# EasyEDA Pro project Main.eprj, board PCB2
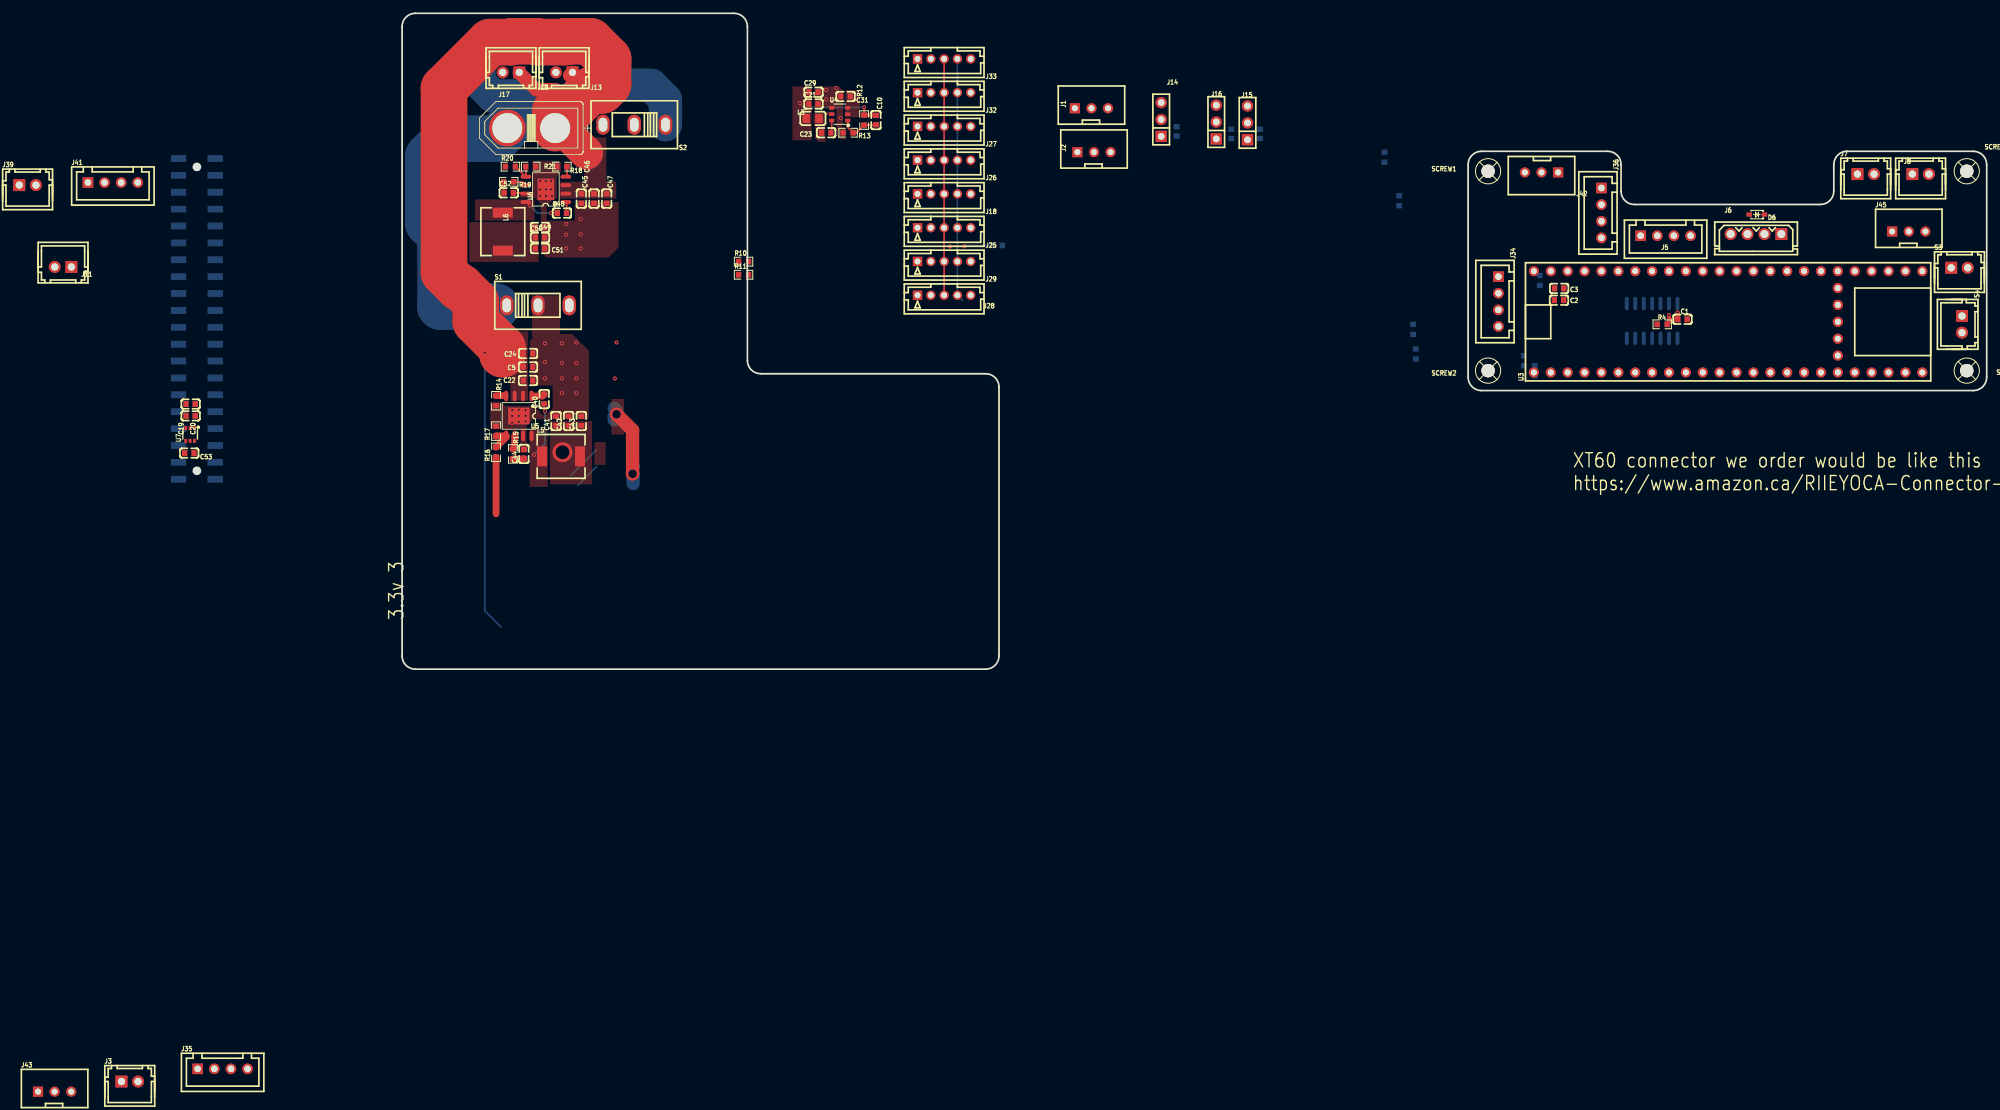
[diagram p8: board, top side]
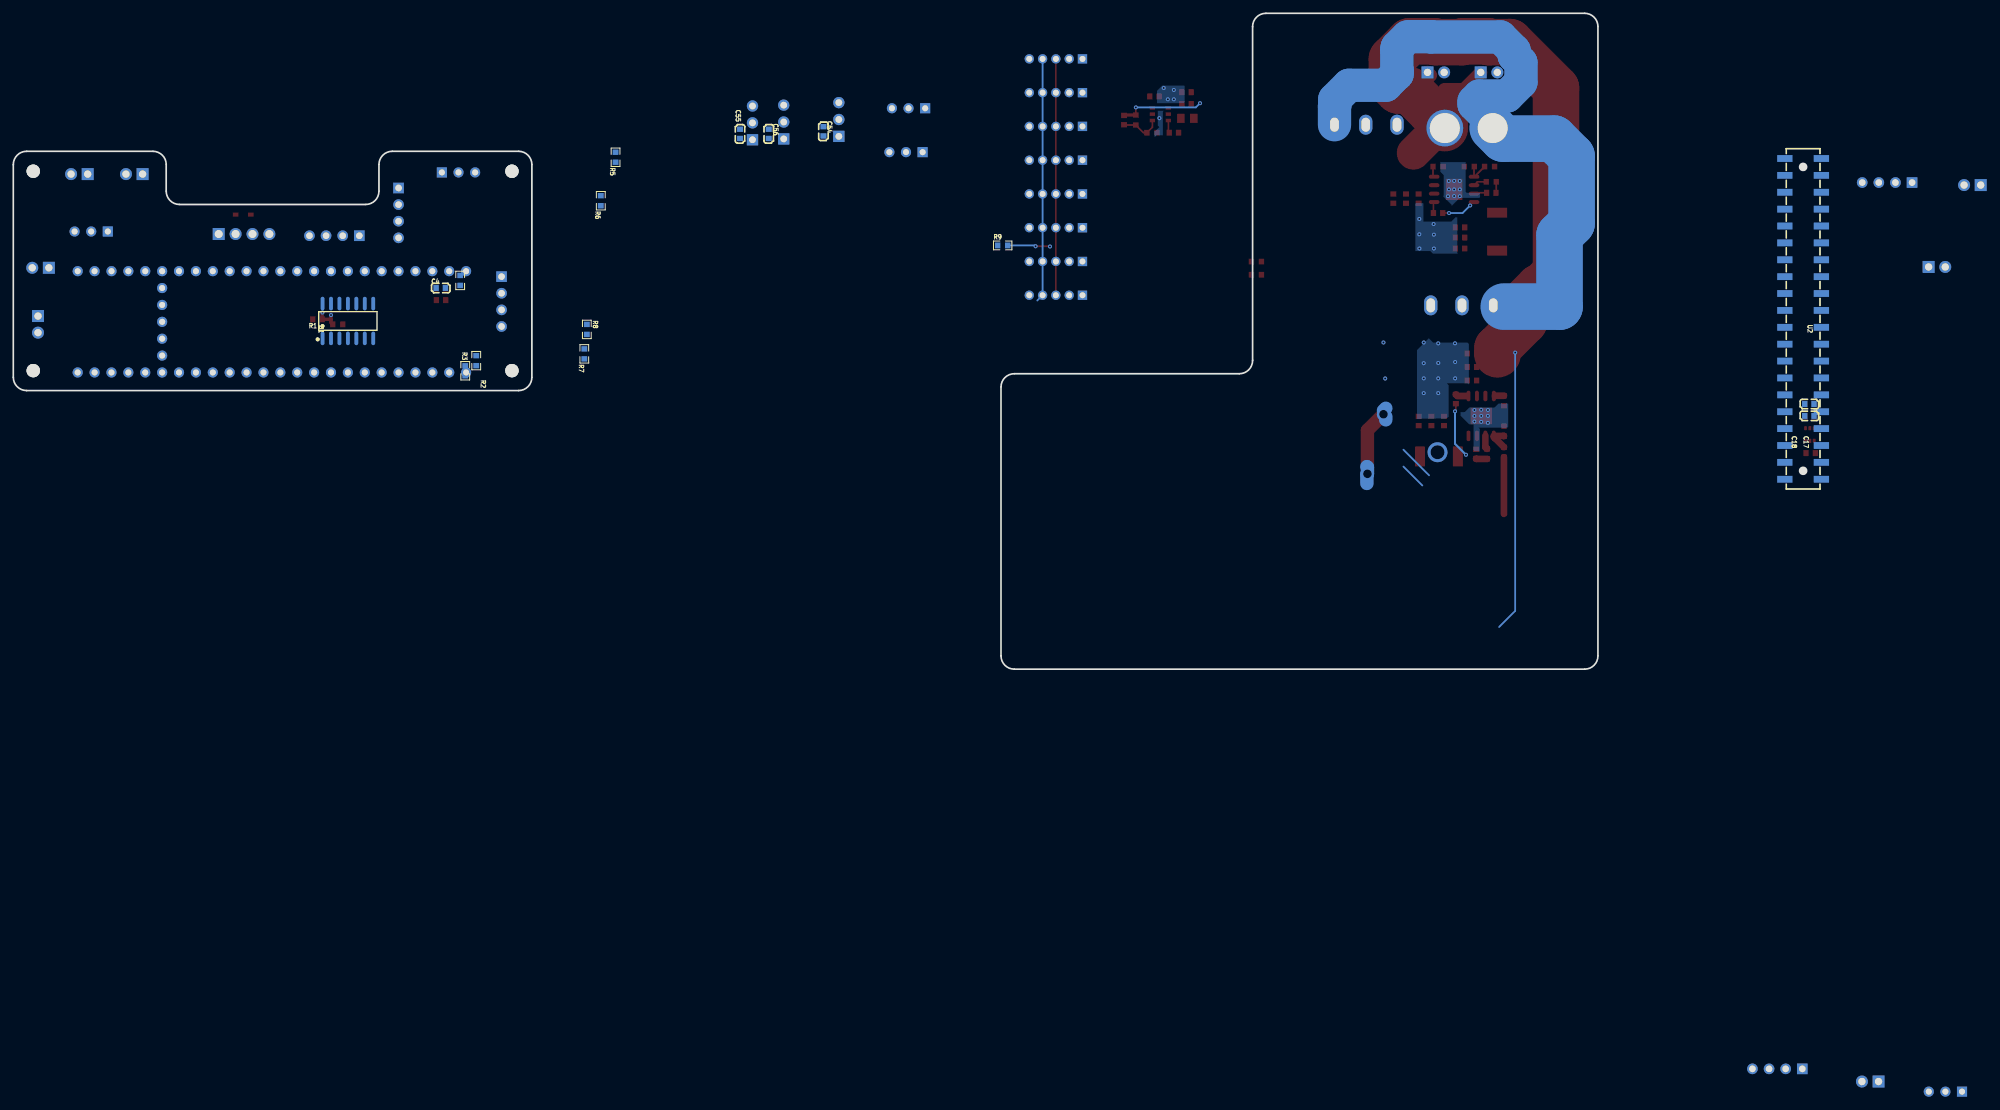
[diagram p9: board, bottom side, seen from below]

Outline 269.86 x 98.68 mm; copper layers: Top Layer, Bottom Layer. Coordinates in mm from the lower left corner of the outline.
Outline path: 31.51,96.68 31.51,2 arc(32.09,0.59) 33.51,0 119.3,0 arc(120.71,0.59) 121.3,2 121.3,42.45 arc(120.71,43.86) 119.3,44.45 85.45,44.45 arc(84.04,45.04) 83.45,46.45 83.45,96.68 arc(82.87,98.09) 81.45,98.68 33.51,98.68 arc(32.09,98.09) 31.51,96.68 ; 191.86,75.92 arc(192.44,77.33) 193.86,77.92 212.86,77.92 arc(214.27,77.33) 214.86,75.92 214.86,71.92 arc(215.44,70.5) 216.86,69.92 244.86,69.92 arc(246.27,70.5) 246.86,71.92 246.86,75.92 arc(247.44,77.33) 248.86,77.92 267.86,77.92 arc(269.27,77.33) 269.86,75.92 269.86,43.92 arc(269.27,42.5) 267.86,41.92 193.86,41.92 arc(192.44,42.5) 191.86,43.92 191.86,75.92
Stack: Top Layer 0.035mm / Dielectric1 1.51mm FR4 er 4.5 / Bottom Layer 0.035mm

## Design rules (mm)
template: Custom Config
spacing copperThickness1oz (default): track to track 0.102, other pairs 0.152 to 0.3
spacing copperThickness2oz: track to track 0.203, other pairs 0.152 to 0.3
track width copperThickness1oz (default): min 0.127, default 0.254, max 7
track width copperThickness2oz: min 0.203, default 0.254, max 7
differential pair differentialPair (default): width min 0.127, default 0.254, max 2.54; gap min 0.152, default 0.152
via viaSize (default): diameter min 0.5, default 0.61, max 10; hole min 0.3, default 0.305, max 6.3

## Placement (name value [footprint] x y rotation side)
C1  100nF  [C0603]  224.1 52.64 180 top
C2  22uF  [C0603]  205.52 55.52 0 top
C3  1uF  [C0603]  205.54 57.29 0 top
C4  100nF  [C0603]  205.56 57.34 0 bottom
C5  10uF  [C0603]  50.46 45.47 0 top
C10  100pF  [C0603]  102.79 82.61 270 top
C17  100nF  [C0603]  -0.3 38.11 180 bottom
C18  1uF  [C0603]  -0.3 39.89 180 bottom
C19  22uF  [C0603]  -0.3 38.11 180 top
C20  47uF  [C0603]  -0.3 39.89 180 top
C21  22uF  [C0603]  93.39 85.03 0 top
C22  10uF  [C0603]  50.46 43.43 0 top
C23  100nF  [C0603]  95.29 80.71 0 top
C24  100nF  [C0603]  50.46 47.5 0 top
C29  22uF  [C0603]  93.39 86.81 0 top
C31  10uF  [C0603]  98.22 86.17 180 top
C40  100nF  [C0603]  52.88 40.64 90 top
C41  22uF  [C0603]  54.66 37.34 90 top
C42  22uF  [C0603]  56.57 37.34 90 top
C43  22uF  [C0603]  58.47 37.34 90 top
C44  2.7nF  [C0603]  49.83 32.38 90 top
C45  10uF  [C0603]  58.48 70.8 270 top
C46  10uF  [C0603]  60.38 70.8 270 top
C47  100nF  [C0603]  62.29 70.8 270 top
C48  100nF  [C0603]  55.55 68.62 0 top
C49  22uF  [C0603]  52.25 66.47 0 top
C50  22uF  [C0603]  52.25 64.94 0 top
C51  22uF  [C0603]  52.25 63.29 0 top
C52  2.7nF  [C0603]  47.55 71.67 0 top
C53  4.7uF  [C0603]  -0.5 32.51 180 top
C54  470uF  [C0603]  148.01 80.92 90 bottom
C55  100uF  [C0603]  160.55 80.54 90 bottom
C56  100uF  [C0603]  156.23 80.54 90 bottom
D6  BAT60B  [SOD-323_L1.7-W1.3-LS2.6-RD-1]  235.28 68.39 180 top
J1  STS3032  [CONN-TH_3P-P2.50_WAFER-XH2.54-3PZZ-H62]  135.2 84.39 0 top
J2  B3B-XH-A(LF)(SN)  [CONN-TH_3P-P2.50_WAFER-XH2.54-3PZZ-H62]  135.58 77.79 0 top
J3  K230 pow  [CONN-TH_2P-P2.50_HX25003-2A]  -9.45 -62.04 0 top
J5  IMU  [CONN-TH_B4B-XH-A-BK-LF-SN]  221.56 65.21 0 top
J6  UART3  [CONN-TH_22035045]  235.15 65.47 0 top
J7  tuch1  [CONN-TH_2P-P2.50_HX25003-2A]  251.66 74.49 0 top
J8  tuch0  [CONN-TH_2P-P2.50_HX25003-2A]  259.92 74.49 0 top
J11  K230 buzzer  [CONN-TH_2P-P2.50_HX25003-2A]  -19.48 60.52 180 top
J12  Voltage Measure  [CONN-TH_2P-P2.50_HX25003-2A]  47.89 89.79 180 top
J13  LEDPower  [CONN-TH_2P-P2.50_HX25003-2A]  55.89 89.79 180 top
J14  PZ254V-11-03P  [HDR-TH_3P-P2.54-V-M_PZ254V-11-03P]  145.69 82.7 90 top
J15  PZ254V-11-03P  [HDR-TH_3P-P2.54-V-M_PZ254V-11-03P]  158.67 82.19 90 top
J16  PZ254V-11-03P  [HDR-TH_3P-P2.54-V-M_PZ254V-11-03P]  153.98 82.32 90 top
J17  XT60-F  [CONN-TH_XT60PB-F]  50.94 81.41 0 top
J18  B5B-PH-K-S(LF)(SN)  [CONN-TH_B5B-PH-K-S-LF-SN]  113.04 71.5 180 top
J25  B5B-PH-K-S(LF)(SN)  [CONN-TH_B5B-PH-K-S-LF-SN]  113.04 66.42 180 top
J26  B5B-PH-K-S(LF)(SN)  [CONN-TH_B5B-PH-K-S-LF-SN]  113.04 76.58 180 top
J27  B5B-PH-K-S(LF)(SN)  [CONN-TH_B5B-PH-K-S-LF-SN]  113.04 81.66 180 top
J28  B5B-PH-K-S(LF)(SN)  [CONN-TH_B5B-PH-K-S-LF-SN]  113.04 56.26 180 top
J29  B5B-PH-K-S(LF)(SN)  [CONN-TH_B5B-PH-K-S-LF-SN]  113.04 61.34 180 top
J32  B5B-PH-K-S(LF)(SN)  [CONN-TH_B5B-PH-K-S-LF-SN]  113.04 86.74 180 top
J33  B5B-PH-K-S(LF)(SN)  [CONN-TH_B5B-PH-K-S-LF-SN]  113.04 91.82 180 top
J34  motSIG  [CONN-TH_B4B-XH-A-BK-LF-SN]  196.42 55.31 270 top
J35  motSIG-pow  [CONN-TH_B4B-XH-A-BK-LF-SN]  4.52 -60.13 0 top
J36  UART5  [CONN-TH_B4B-XH-A-BK-LF-SN]  211.91 68.64 270 top
J39  K230 pow  [CONN-TH_2P-P2.50_HX25003-2A]  -24.82 72.83 0 top
J41  k230D UART  [CONN-TH_B4B-XH-A-BK-LF-SN]  -11.99 73.22 0 top
J42  TeencyPow  [CONN-TH_3P-P2.50_WAFER-XH2.54-3PZZ-H62]  202.89 74.74 180 top
J43  TeencyPow  [CONN-TH_3P-P2.50_WAFER-XH2.54-3PZZ-H62]  -20.75 -63.56 0 top
J45  cnduct  [CONN-TH_3P-P2.50_WAFER-XH2.54-3PZZ-H62]  258.14 65.85 0 top
L3  6.8uH  [L0805]  93.26 82.87 180 top
L5  3.3uH  [IND-SMD_CYA0650-3.3UH]  55.42 32 0 top
L6  3.3uH  [IND-SMD_CYA0650-3.3UH]  46.66 65.83 270 top
R1  10kΩ  [R0603]  202.64 58.48 90 bottom
R2  3.3kΩ  [R0603]  200.23 46.42 90 bottom
R3  4.7kΩ  [R0603]  201.88 44.89 270 bottom
R4  2.2kΩ  [R0603]  221.06 51.88 0 top
R5  1kΩ  [R0603]  179.27 77.03 90 bottom
R6  1kΩ  [R0603]  181.49 70.48 90 bottom
R7  1kΩ  [R0603]  183.97 47.43 90 bottom
R8  1kΩ  [R0603]  183.59 51.12 270 bottom
R9  1kΩ  [R0603]  121.04 63.75 180 bottom
R10  4.7kΩ  [R0603]  82.88 61.32 0 top
R11  3.3kΩ  [R0603]  82.88 59.34 0 top
R12  196kΩ  [R0603]  101.01 82.61 270 top
R13  62kΩ  [R0603]  98.6 80.71 180 top
R14  200kΩ  [R0603]  45.64 40.39 270 top
R15  15.8kΩ  [R0603]  48.18 32.38 270 top
R16  115kΩ  [R0603]  45.64 32.64 90 top
R17  22.1kΩ  [R0603]  45.64 35.81 90 top
R18  200kΩ  [R0603]  55.55 75.61 180 top
R19  15.8kΩ  [R0603]  47.55 73.32 180 top
R20  115kΩ  [R0603]  47.81 75.61 0 top
R21  22.1kΩ  [R0603]  50.86 75.61 0 top
S1  SS-12M11G4  [SW-TH_XKB_SS-12M11XX]  51.95 54.74 0 top
S2  SS-12M11G4  [SW-TH_XKB_SS-12M11XX]  66.43 81.91 180 top
S3  Start SW  [CONN-TH_2P-P2.50_HX25003-2A]  265.76 60.39 0 top
S4  RST SW  [CONN-TH_2P-P2.50_HX25003-2A]  266.14 51.88 270 top
SCREW1  -  [Screw-Hole-M2]  194.86 74.92 0 top
SCREW2  -  [Screw-Hole-M2]  194.86 44.92 0 top
SCREW3  -  [Screw-Hole-M2]  266.86 74.92 0 top
SCREW4  -  [Screw-Hole-M2]  266.86 44.92 0 top
U1  CD74HCT126M96  [SOIC-14_L8.7-W3.9-P1.27-LS6.0-BL]  219.53 52.39 180 bottom
U2  FH-00148  [HDR-SMD_40P-P2.54-V-F-R2-C20-S7.1-EH]  0.65 52.7 90 bottom
U3  -  [TEENSY 4.1]  232.1 52.26 90 top
U4  AP63201WU-7  [TSOT-23-6_L2.9-W1.6-P0.95-LS2.8-BR]  97.33 83.5 0 top
U5  AP64500SP-13  [SO-8_L4.9-W3.9-P1.27-LS6.0-BL-EP]  49.07 38.1 180 top
U6  AP64500SP-13  [SO-8_L4.9-W3.9-P1.27-LS6.0-BL-EP]  53.14 72.18 90 top
U7  SIP32411DR-T1-GE3  [SC-70-6_L2.1-W1.3-P0.65-LS2.1-BR]  -0.37 35.31 90 top

## Footprints (pads in the part's own frame, mm; a bottom-side part is the same pattern mirrored in y, then rotated)
C0603
  rect 0.8x0.9 smd: 1(-0.7,0) 2(0.7,0)
CONN-TH_2P-P2.50_HX25003-2A
  rect 1.8x1.8 hole 1.1: 1(-1.25,0)
  round 1.8 hole 1.1: 2(1.25,0)
CONN-TH_3P-P2.50_WAFER-XH2.54-3PZZ-H62
  rect 1.524x1.524 hole 0.914: 1(-2.5,0)
  round 1.524 hole 0.914: 2(0,0) 3(2.5,0)
CONN-TH_22035045
  rect 1.8x1.8 hole 1.2: 1(3.81,0)
  round 1.8 hole 1.2: 2(1.27,0) 3(-1.27,0) 4(-3.81,0)
CONN-TH_B4B-XH-A-BK-LF-SN
  rect 1.6x1.6 hole 1: 1(-3.75,0)
  round 1.6 hole 1: 2(-1.25,0) 3(1.25,0) 4(3.75,0)
CONN-TH_B5B-PH-K-S-LF-SN
  rect 1.4x1.4 hole 0.9: 1(4,0)
  round 1.4 hole 0.9: 2(2,0) 3(0,0) 4(-2,0) 5(-4,0)
CONN-TH_XT60PB-F
  round 5.516 hole 4.505x4.5: +(3.6,0) -(-3.6,0)
HDR-SMD_40P-P2.54-V-F-R2-C20-S7.1-EH
  rect 1.02x2.3 smd: 1(-24.13,-2.75) 2(-24.13,2.75) 3(-21.59,-2.75) 4(-21.59,2.75) 5(-19.05,-2.75) 6(-19.05,2.75) 7(-16.51,-2.75) 8(-16.51,2.75) 9(-13.97,-2.75) 10(-13.97,2.75) 11(-11.43,-2.75) 12(-11.43,2.75) 13(-8.89,-2.75) 14(-8.89,2.75) 15(-6.35,-2.75) 16(-6.35,2.75) 17(-3.81,-2.75) 18(-3.81,2.75) 19(-1.27,-2.75) 20(-1.27,2.75) 21(1.27,-2.75) 22(1.27,2.75) 23(3.81,-2.75) 24(3.81,2.75) 25(6.35,-2.75) 26(6.35,2.75) 27(8.89,-2.75) 28(8.89,2.75) 29(11.43,-2.75) 30(11.43,2.75) 31(13.97,-2.75) 32(13.97,2.75) 33(16.51,-2.75) 34(16.51,2.75) 35(19.05,-2.75) 36(19.05,2.75) 37(21.59,-2.75) 38(21.59,2.75) 39(24.13,-2.75) 40(24.13,2.75)
HDR-TH_3P-P2.54-V-M_PZ254V-11-03P
  rect 1.7x1.7 hole 1.02: 1(-2.54,0)
  round 1.7 hole 1.02: 2(0,0) 3(2.54,0)
IND-SMD_CYA0650-3.3UH
  rect 1.5x3 smd: 1(-2.85,0) 2(2.85,0)
L0805
  rect 1.133x1.377 smd: 1(-0.966,0) 2(0.966,0)
R0603
  rect 0.806x0.864 smd: 1(-0.753,0) 2(0.753,0)
SC-70-6_L2.1-W1.3-P0.65-LS2.1-BR
  rect 0.6x0.42 smd: 1(0.95,-0.65) 2(0.95,0) 3(0.95,0.65) 4(-0.95,0.65) 5(-0.95,0) 6(-0.95,-0.65)
Screw-Hole-M2
  round 2 hole 2: 1(0,0)
SO-8_L4.9-W3.9-P1.27-LS6.0-BL-EP
  oval 0.6x1.6 smd: 1(-1.905,-3) 2(-0.635,-3) 3(0.635,-3) 4(1.905,-3) 5(1.905,3) 6(0.635,3) 7(-0.635,3) 8(-1.905,3)
  rect 3.2x2.5 smd: 9(0,0)
SOD-323_L1.7-W1.3-LS2.6-RD-1
  rect 0.83x0.63 smd: 1(-1.14,0) 2(1.14,0)
SOIC-14_L8.7-W3.9-P1.27-LS6.0-BL
  oval 0.574x2.038 smd: 1(-3.81,-2.619) 2(-2.54,-2.619) 3(-1.27,-2.619) 4(0,-2.619) 5(1.27,-2.619) 6(2.54,-2.619) 7(3.81,-2.619) 8(3.81,2.619) 9(2.54,2.619) 10(1.27,2.619) 11(0,2.619) 12(-1.27,2.619) 13(-2.54,2.619) 14(-3.81,2.619)
SW-TH_XKB_SS-12M11XX
  oval 2x3 hole 1.3x2.1: 1(-4.7,0) 2(0,0) 3(4.7,0)
TEENSY 4.1
  round 1.524 hole 0.914: 1(-7.62,30.353) 2(-7.62,27.813) 3(-7.62,25.273) 4(-7.62,22.733) 5(-7.62,20.193) 6(-7.62,17.653) 7(-7.62,15.113) 8(-7.62,12.573) 9(-7.62,10.033) 10(-7.62,7.493) 11(-7.62,4.953) 12(-7.62,2.413) 13(-7.62,-0.127) 14(-7.62,-2.667) 15(-7.62,-5.207) 16(-7.62,-7.747) 17(-7.62,-10.287) 18(-7.62,-12.827) 19(-7.62,-15.367) 20(-7.62,-17.907) 21(-7.62,-20.447) 22(-7.62,-22.987) 23(-7.62,-25.527) 24(-7.62,-28.067) 25(7.62,30.353) 26(7.62,27.813) 27(7.62,25.273) 28(7.62,22.733) 29(7.62,20.193) 30(7.62,17.653) 31(7.62,15.113) 32(7.62,12.573) 33(7.62,10.033) 34(7.62,7.493) 35(7.62,4.953) 36(7.62,2.413) 37(7.62,-0.127) 38(7.62,-2.667) 39(7.62,-5.207) 40(7.62,-7.747) 41(7.62,-10.287) 42(7.62,-12.827) 43(7.62,-15.367) 44(7.62,-17.907) 45(7.62,-20.447) 46(7.62,-22.987) 47(7.62,-25.527) 48(7.62,-28.067) 49(5.08,-15.367) 50(2.54,-15.367) 51(0,-15.367) 52(-2.54,-15.367) 53(-5.08,-15.367)
TSOT-23-6_L2.9-W1.6-P0.95-LS2.8-BR
  rect 0.8x0.532 smd: 1(1.2,-0.95) 2(1.2,0) 3(1.2,0.95) 4(-1.2,0.95) 5(-1.2,0) 6(-1.2,-0.95)

## Nets
As in the schematic, except:
TEENSY_24: J25.5 U3.16
TEENSY_25: J18.5 U3.17
TEENSY_26: J26.5 U3.18
TEENSY_27: J27.5 U3.19
TEENSY_28: J28.5 U3.20
TEENSY_29: J29.5 U3.21
TEENSY_30: J32.5 U3.22
TEENSY_31: J33.5 U3.23
TEENSY_K230_ENABLE: J36.1 U3.8

Pads without a net: S1 3; S2 3; SCREW1 1; SCREW2 1; SCREW3 1; SCREW4 1; U2 1 8 10 11 12 13 15 16 17 18 19 21 22 23 24 26 27 28 29 31 32 33 35 36 37 38 40; U3 7 9 11 12 13 14 15 24 29 38 40 41 46 48 49 52 53; U7 6

## Via types
v1: diameter 0.61, hole 0.305, Top Layer to Bottom Layer, 53 vias
v2: diameter 3, hole 2.1, Top Layer to Bottom Layer, 1 via
v3: diameter 2, hole 1.3, Top Layer to Bottom Layer, 2 vias

## Routing (per net, layer and track width the routed paths; a pad name or vN(x,y) marks a point on that pad's centre or on a via; arc(x,y) is an arc through that point)
+5V: length 3.9
  Top Layer w0.508: 222.07,52.64 222.07,52.64 v1(222.07,53.28) ; 222.07,52.64 C1.2 223.4,53.61 v1(223.36,53.66) ; 222.07,52.64 222.07,52.14 R4.2
+5VM: length 8.5
  Top Layer w1: R16.1 45.64,23.37
  vias: v2(55.64,32.64)
+BATT: length 146.6
  Top Layer w2: 49.14,89.74 51.69,87.19 54.54,87.19 54.54,83.94 ; J13.1 56.69,89.34
  Top Layer w5: 59.26,77.66 55.51,81.41 J17.+
  Top Layer w7: 46.62,47.37 46.62,48.29 42.6,52.31 42.6,55.21 40.36,57.46 40.04,57.46 37.82,59.68 37.82,87.4 44.76,94.34 47.93,94.34 48.06,94.47 51.83,94.47 51.96,94.34 55.93,94.34 56.06,94.47 59.83,94.47 62.5,91.8 62.5,88.03 61.53,87.07 59.81,87.07 56.68,83.94 54.54,83.94 ; J17.+ 54.54,82.99
  Bottom Layer w0.254: 46.37,6.35 43.95,8.76 v1(43.95,47.62)
K230D_BUZZER: length 6.5
  Top Layer w0.254: 113.93,63.5 114.06,63.63 v1(116.09,63.63)
  Bottom Layer w0.254: R9.2 116.22,63.75 v1(116.09,63.63)
  vias: v1(113.93,63.59)
K230RX: length 4
  Bottom Layer w0.254: 60.76,30.48 57.92,27.64
K230TX: length 5.5
  Bottom Layer w0.254: 60.76,33.02 56.91,29.17
MGND:
  vias: v1(48.06,38.99) v1(48.06,38.1) v1(48.06,37.06) v1(49.07,39.02) v1(49.07,38.1) v1(49.07,37.2) v1(50.09,38.99) v1(50.09,38.1) v1(50.09,37.26) v1(53.01,49.02) v1(52.99,46.21) v1(52.99,43.75) v1(55.53,49.02) v1(55.53,46.07) v1(55.53,43.75) v1(55.53,41.53) v1(57.71,49.15) v1(57.71,46.04) v1(57.71,43.75) v1(57.71,41.53)
POWER_GND: length 14.7
  Top Layer w0.254: U6.7 50.01,71.67 C52.2 ; 101.01,83.37 v1(101.01,84.52)
  Top Layer w0.5: 101.01,83.37 102.73,83.37
  Bottom Layer w0.254: v1(101.01,84.52) 91.99,84.52 v1(91.36,85.15)
  vias: v1(52.28,73.45) v1(52.28,72.18) v1(52.28,71.16) v1(53.14,73.45) v1(53.14,72.18) v1(53.14,71.19) v1(53.94,73.45) v1(53.92,72.18) v1(54.06,71.16) v1(56.18,65.37) v1(56.18,63.29) v1(56.22,66.97) v1(58.38,67.73) v1(58.38,65.43) v1(58.36,63.29) v1(63.51,43.73) v1(63.77,49.15) v1(95.3,87.14) v1(95.3,85.74) v1(96.2,85.74) v1(96.82,87.44) v1(97.48,82.9)
TEENSY_24: length 0.1
  Top Layer w0.254: J25.5 117.08,66.38
TEENSY_SCL-0: length 36.7
  Bottom Layer w0.254: J33.4 J32.4 J27.4 J26.4 J18.4 J25.4 J29.4 J28.4 115.84,55.47
TEENSY_SDA-0: length 35.6
  Top Layer w0.254: J33.3 J32.3 J27.3 J26.3 J18.3 J25.3 J29.3 J28.3
$1N12: length 6.1
  Top Layer w0.254: C10.2 102.73,81.86 R12.2 99.86,80.71 R13.1 98.53,81.53 U4.1
$1N113: length 1.9
  Top Layer w0.254: C23.2 96.13,80.84 U4.6
$1N133: length 101.9
  Bottom Layer w5: J17.- 47.34,82.17 50.14,84.97 50.14,85.43 49.33,86.24 45.17,86.24 43.09,88.32 43.09,91.26 44.1,92.28 44.1,93.04 46.19,95.12 56.62,95.12 56.67,95.17 59.65,95.17 59.7,95.12 60.16,95.12 61.71,93.57 61.71,93.11 61.76,93.06 61.76,90.07 61.71,90.02 61.71,89.57 63.43,87.84 68.96,87.84 71.1,85.71 71.1,84.74 71.13,84.71 S2.1
  Bottom Layer w7: J17.- 45.75,79.82 38.13,79.82 35.47,77.16 35.47,67.11 37.29,65.29 37.29,54.55 ; 37.29,54.55 45.67,54.55
$1N12541: length 13.6
  Top Layer w2: v3(63.77,38.35) 66.18,35.94 v3(66.18,29.39)
  Bottom Layer w2: 66.26,30.48 66.18,30.4 v3(66.18,29.39) 66.26,29.31 66.26,27.94 ; 63.42,38.01 63.42,37.51 ; 63.77,38.91 63.42,39.25
$1N35510: length 1.7
  Top Layer w1: C40.2 52.64,41.1 51.27,41.1
$1N35520: length 8.4
  Top Layer w0.254: C40.1 52.88,38.92 v1(53.01,38.8)
  Bottom Layer w0.3: v1(51.36,32.26) 53.01,33.91 v1(53.01,38.8)
$1N35575: length 3.9
  Top Layer w1: R17.1 45.68,35.1 U5.5 47.17,34.92 R16.2
$1N35837: length 2.1
  Top Layer w1: R15.1 48.44,33.39 U5.6
$1N35914: length 1.7
  Top Layer w1: C44.1 49.78,31.63 R15.2
$1N35993: length 1.4
  Top Layer w1: 47,41.1 46.96,41.14 R14.1
$1N36774: length 1.7
  Top Layer w0.254: U6.1 56.25,70.16 C48.2
$1N36776: length 4.6
  Top Layer w0.254: C48.1 v1(53.9,68.62)
  Bottom Layer w0.254: v1(53.9,68.62) 51.87,68.62 v1(50.73,69.77)
$1N36782: length 3.8
  Top Layer w0.254: R21.1 50.14,75.57 U6.5 50.08,74.09 R20.2
$1N36795: length 2
  Top Layer w0.254: R19.1 49.63,73.32 U6.6
$1N36798: length 1.7
  Top Layer w0.254: C52.1 46.8,71.73 46.8,73.32
$1N36802: length 1.6
  Top Layer w0.254: U6.4 56.31,74.25 56.31,75.61

## Copper pours and planes (outline as drawn; the poured copper is in the pictures)
+5V on Top Layer: 41.62,67.25 52.06,67.25 52.06,61.26 41.62,61.26
+5V on Top Layer: 60.46,34.16 62.11,34.16 62.11,30.73 60.46,30.73
+5VM on Top Layer: 58.56,34.14 59.69,34.14 59.69,28.32 58.56,28.32
+5VM on Top Layer: 53.77,37.34 60.08,37.34 60.08,27.81 53.77,27.81
+BATT on Top Layer: 47.8,50.8 50.47,50.8 50.47,40.39 47.8,40.39
+BATT on Top Layer: 58.91,80.01 62.24,80.01 62.24,73.03 58.91,73.03
+BATT on Top Layer: 55.14,73.33 63.74,73.33 63.74,70.8 55.14,70.8
+BATT on Top Layer: 98.19,87.13 100.37,87.13 100.37,84.14 98.19,84.14
+BATT on Top Layer: 98.19,84.14 100.35,84.14 100.35,83.04 98.19,83.04
MGND on Top Layer: 51.07,56.24 55.28,56.24 55.28,49.02 51.07,49.02
MGND on Top Layer: 44.75,50.42 59.61,50.42 59.61,36.1 44.75,36.1
MGND on Top Layer: 49.33,36.83 50.23,36.83 50.23,32.51 49.33,32.51
MGND on Bottom Layer: 50.92,49.78 58.72,49.78 58.72,37.68 50.92,37.68
MGND on Bottom Layer: 45.01,39.96 52.18,39.96 52.18,32.77 45.01,32.77
POWER_GND on Top Layer: 90.21,87.69 93.14,87.69 93.14,79.57 90.21,79.57
POWER_GND on Top Layer: 49.2,76.5 64.06,76.5 64.06,61.9 49.2,61.9
POWER_GND on Top Layer: 93.52,87.68 98.3,87.68 98.3,79.71 93.52,79.71
POWER_GND on Bottom Layer: 96.82,84.01 98.22,84.01 98.22,80.05 96.82,80.05
POWER_GND on Bottom Layer: 52.53,70.12 58.98,70.12 58.98,62.53 52.53,62.53
POWER_GND on Bottom Layer: 49.24,76.37 55.21,76.37 55.21,69.68 49.24,69.68
POWER_GND on Bottom Layer: 93.69,87.82 97.83,87.82 97.83,85.15 93.69,85.15
$1N29 on Top Layer: 93.39,83.89 96.56,83.89 96.56,79.33 93.39,79.33
$1N12541 on Top Layer: 62.98,40.64 64.91,40.64 64.91,35.3 62.98,35.3
$1N35520 on Top Layer: 50.72,36.07 53.39,36.07 53.39,27.43 50.72,27.43
$1N36776 on Top Layer: 42.47,70.66 51.46,70.66 51.46,67.47 42.47,67.47

## Text on the board
Top Silkscreen Layer: 3.3v 3 | J5 -> XH / J6~J10 -> XH 2pin, and you can utilize bottom layer as well / lets try to follow the regulator pcb design as close to instructed | XT60 connector we order would be like this / https://www.amazon.ca/RIIEYOCA-Connector-Extension-Quadcopter-XT60-male/dp/B09L62W679/ref=asc_df_B09L62W679?mcid=5ea187ce5ddb3fdd8b7d2b90c9799982&tag=googleshopc0c-20&linkCode=df0&hvadid=706743214245&hvpos=&hvnetw=g&hvrand=18416964478274017855&hvpone=&hvptwo=&hvqmt=&hvdev=c&hvdvcmdl=&hvlocint=&hvlocphy=9191846&hvtargid=pla-1730363463987&hvocijid=18416964478274017855-B09L62W679-&hvexpln=0&gad_source=1&th=1
